# EAGLE schematic Protein (EAGLE 6.5.0)

## Sheet 1 of 2
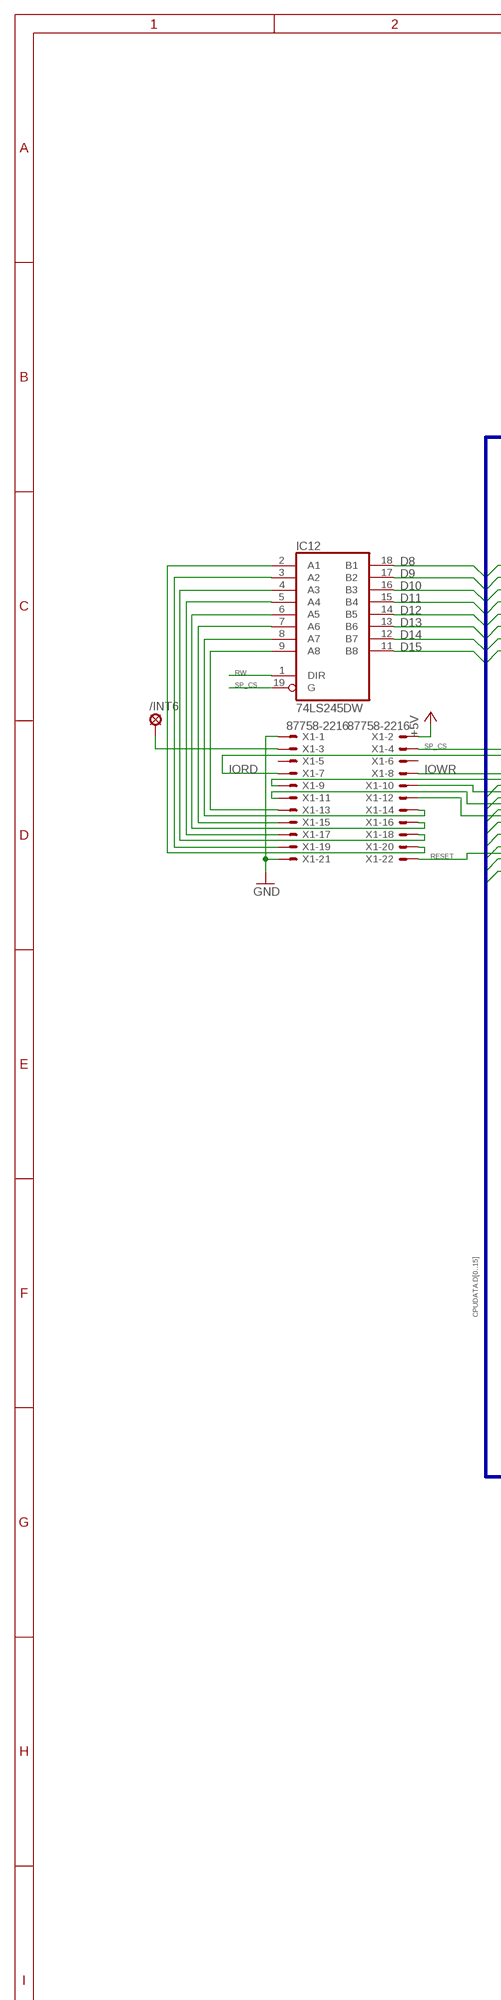
[diagram p0: schematic, sheet 1, part 1 of 2]
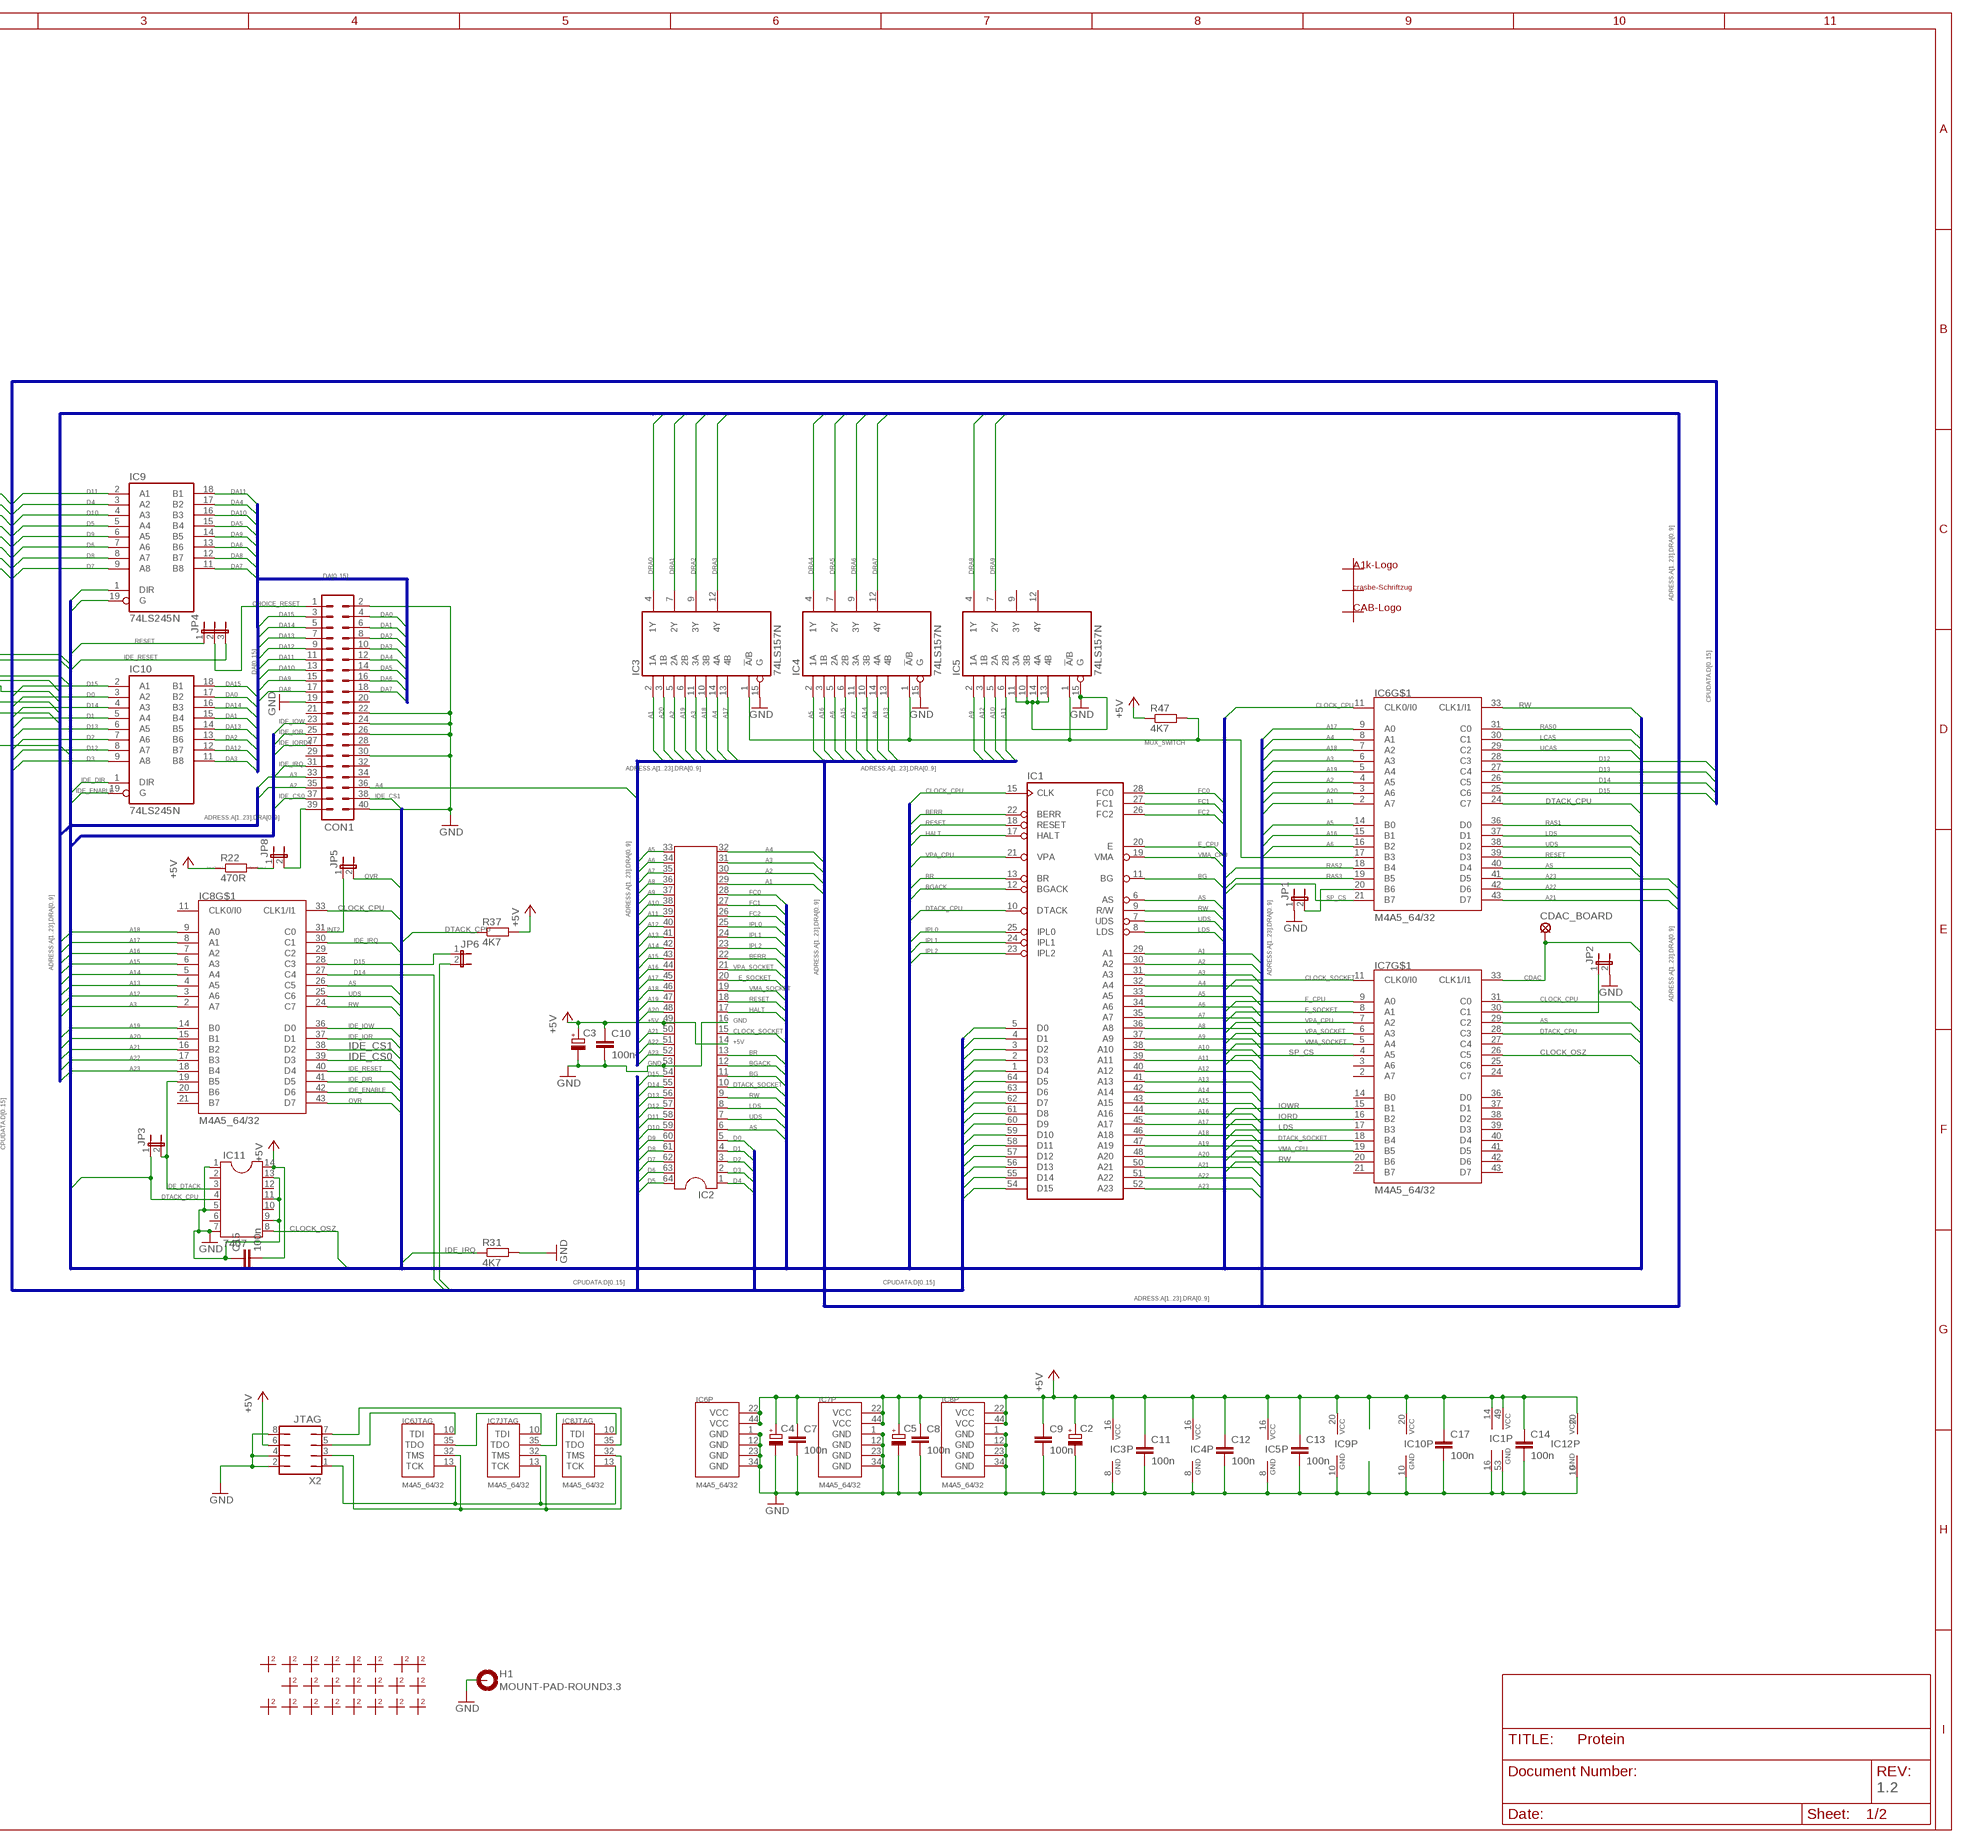
[diagram p1: schematic, sheet 1, part 2 of 2]

### Parts
/INT6  SE11  [SE11]
C2  CPOL-EUE2.5-7  [E2,5-7]
C3  CPOL-EUE2.5-7  [E2,5-7]
C4  CPOL-EUE2.5-7  [E2,5-7]
C5  CPOL-EUE2.5-7  [E2,5-7]
C7  100n  C-EU025-024X044  [C025-024X044]
C8  100n  C-EU025-024X044  [C025-024X044]
C9  100n  C-EU025-024X044  [C025-024X044]
C10  100n  C-EU025-024X044  [C025-024X044]
C11  100n  C-EU025-024X044  [C025-024X044]
C12  100n  C-EU025-024X044  [C025-024X044]
C13  100n  C-EU025-024X044  [C025-024X044]
C14  100n  C-EUC1206K  [C1206K]
C15  100n  C-EU025-024X044  [C025-024X044]
C17  100n  C-EU025-024X044  [C025-024X044]
CDAC_BOARD  SE11  [SE11]
CON1  ML40  [ML40]
H1  MOUNT-PAD-ROUND3.3  [3,3-PAD]
IC1  MC68000P  [DIL64]
IC2  DIL64  [DIL64]
IC3  74LS157N  74157N  [DIL16]
IC4  74LS157N  74157N  [DIL16]
IC5  74LS157N  74157N  [DIL16]
IC6  M4A5_64/32  [PLCC-S44]
IC7  M4A5_64/32  [PLCC-S44]
IC8  M4A5_64/32  [PLCC-S44]
IC9  74LS245N  [DIL20]
IC10  74LS245N  [DIL20]
IC11  7407  DIL14  [DIL14]
IC12  74LS245DW  [SO20W]
JP1  JP1E  [JP1]
JP2  JP1E  [JP1]
JP3  JP1E  [JP1]
JP4  JP2E  [JP2]
JP5  JP1E  [JP1]
JP6  JP1E  [JP1]
JP8  JP1E  [JP1]
R22  470R  R0207/10  [0207/10]
R31  4K7  R-EU_M0805  [M0805]
R37  4K7  R-EU_M0805  [M0805]
R47  4K7  R-EU_M0805  [M0805]
U$1  A1K  [A1K]
U$2  CRASBE  [CRASBE]
U$3  CAB  [CAB-LOGO]
U$5  BREAD_2  [BREAD]
U$8  BREAD_2  [BREAD]
U$9  BREAD_2  [BREAD]
U$10  BREAD_2  [BREAD]
U$11  BREAD_2  [BREAD]
U$13  BREAD_2  [BREAD]
U$14  BREAD_2  [BREAD]
U$15  BREAD_2  [BREAD]
U$16  BREAD_2  [BREAD]
U$17  BREAD_2  [BREAD]
U$18  BREAD_2  [BREAD]
U$19  BREAD_2  [BREAD]
U$20  BREAD_2  [BREAD]
U$21  BREAD_2  [BREAD]
U$22  BREAD_2  [BREAD]
U$23  BREAD_2  [BREAD]
U$24  BREAD_2  [BREAD]
U$25  BREAD_2  [BREAD]
U$26  BREAD_2  [BREAD]
U$27  BREAD_2  [BREAD]
U$28  BREAD_2  [BREAD]
U$29  BREAD_2  [BREAD]
U$30  BREAD_2  [BREAD]
X1  87758-2216  [87758-2216]
X2  JTAG  JP4Q  [JP4Q]

### Nets
+5V: C2.+ C3.+ C4.+ C5.+ C7.1 C8.1 C9.1 C10.1 C11.1 C12.1 C13.1 C14.1 C15.2 C17.1 IC1.14(VCC) IC1.49(VCC) IC2.14 IC2.49 IC3.16(VCC) IC4.16(VCC) IC5.16(VCC) IC6.22(P:VCC) IC6.44(P:VCC) IC7.22(P:VCC) IC7.44(P:VCC) IC8.22(P:VCC) IC8.44(P:VCC) IC9.20(VCC) IC10.20(VCC) IC11.14 IC12.20(VCC) R22.1 R37.2 R47.1 X1.2 X2.6 ; also sheet 2
A1: IC1.29(A1) IC2.29 IC3.2(1A) IC6.2(A7)
A2: CON1.35 IC1.30(A2) IC2.30 IC3.5(2A) IC6.4(A5) X1.12
A3: CON1.33 IC1.31(A3) IC2.31 IC3.11(3A) IC6.6(A3) IC8.2(A7) X1.11
A4: CON1.36 IC1.32(A4) IC2.32 IC3.14(4A) IC6.8(A1) X1.10
A5: IC1.33(A5) IC2.33 IC4.2(1A) IC6.14(B0) X1.9
A6: IC1.34(A6) IC2.34 IC4.5(2A) IC6.16(B2)
A7: IC1.35(A7) IC2.35 IC4.11(3A)
A8: IC1.36(A8) IC2.36 IC4.14(4A)
A9: IC1.37(A9) IC2.37 IC5.2(1A)
A10: IC1.38(A10) IC2.38 IC5.5(2A)
A11: IC1.39(A11) IC2.39 IC5.6(2B)
A12: IC1.40(A12) IC2.40 IC5.3(1B) IC8.3(A6)
A13: IC1.41(A13) IC2.41 IC4.13(4B) IC8.4(A5)
A14: IC1.42(A14) IC2.42 IC4.10(3B) IC8.5(A4)
A15: IC1.43(A15) IC2.43 IC4.6(2B) IC8.6(A3)
A16: IC1.44(A16) IC2.44 IC4.3(1B) IC6.15(B1) IC8.7(A2)
A17: IC1.45(A17) IC2.45 IC3.13(4B) IC6.9(A0) IC8.8(A1)
A18: IC1.46(A18) IC2.46 IC3.10(3B) IC6.7(A2) IC8.9(A0)
A19: IC1.47(A19) IC2.47 IC3.6(2B) IC6.5(A4) IC8.14(B0)
A20: IC1.48(A20) IC2.48 IC3.3(1B) IC6.3(A6) IC8.15(B1)
A21: IC1.50(A21) IC2.50 IC6.43(D7) IC8.16(B2)
A22: IC1.51(A22) IC2.51 IC6.42(D6) IC8.17(B3)
A23: IC1.52(A23) IC2.52 IC6.41(D5) IC8.18(B4)
AS: IC1.6(AS) IC2.6 IC6.40(D4) IC7.29(C2) IC8.26(C5)
BERR: IC1.22(BERR) IC2.22
BG: IC1.11(BG) IC2.11
BGACK: IC1.12(BGACK) IC2.12
BR: IC1.13(BR) IC2.13
CDAC: CDAC_BOARD.MP IC7.33(CLK1/I1)
CHOICE_RESET: CON1.1 JP4.2
CLOCK_CPU: IC1.15(CLK) IC6.11(CLK0/I0) IC7.31(C0) IC8.33(CLK1/I1)
CLOCK_OSZ: IC7.26(C5) IC11.8
CLOCK_SOCKET: IC2.15 IC7.11(CLK0/I0)
D0: IC1.5(D0) IC2.5 IC10.3(A2) ; also sheet 2
D1: IC1.4(D1) IC2.4 IC10.5(A4) ; also sheet 2
D2: IC1.3(D2) IC2.3 IC10.7(A6) ; also sheet 2
D3: IC1.2(D3) IC2.2 IC10.9(A8) ; also sheet 2
D4: IC1.1(D4) IC2.1 IC9.3(A2) ; also sheet 2
D5: IC1.64(D5) IC2.64 IC9.5(A4) ; also sheet 2
D6: IC1.63(D6) IC2.63 IC9.7(A6) ; also sheet 2
D7: IC1.62(D7) IC2.62 IC9.9(A8) ; also sheet 2
D8: IC1.61(D8) IC2.61 IC9.8(A7) IC12.18(B1) ; also sheet 2
D9: IC1.60(D9) IC2.60 IC9.6(A5) IC12.17(B2) ; also sheet 2
D10: IC1.59(D10) IC2.59 IC9.4(A3) IC12.16(B3) ; also sheet 2
D11: IC1.58(D11) IC2.58 IC9.2(A1) IC12.15(B4) ; also sheet 2
D12: IC1.57(D12) IC2.57 IC6.28(C3) IC10.8(A7) IC12.14(B5) ; also sheet 2
D13: IC1.56(D13) IC2.56 IC6.27(C4) IC10.6(A5) IC12.13(B6) ; also sheet 2
D14: IC1.55(D14) IC2.55 IC6.26(C5) IC8.27(C4) IC10.4(A3) IC12.12(B7) ; also sheet 2
D15: IC1.54(D15) IC2.54 IC6.25(C6) IC10.2(A1) IC12.11(B8) JP6.2 ; also sheet 2
DA0: CON1.4 IC10.17(B2)
DA1: CON1.6 IC10.15(B4)
DA2: CON1.8 IC10.13(B6)
DA3: CON1.10 IC10.11(B8)
DA4: CON1.12 IC9.17(B2)
DA5: CON1.14 IC9.15(B4)
DA6: CON1.16 IC9.13(B6)
DA7: CON1.18 IC9.11(B8)
DA8: CON1.17 IC9.12(B7)
DA9: CON1.15 IC9.14(B5)
DA10: CON1.13 IC9.16(B3)
DA11: CON1.11 IC9.18(B1)
DA12: CON1.9 IC10.12(B7)
DA13: CON1.7 IC10.14(B5)
DA14: CON1.5 IC10.16(B3)
DA15: CON1.3 IC10.18(B1)
DRA0: IC3.4(1Y) ; also sheet 2
DRA1: IC3.7(2Y) ; also sheet 2
DRA2: IC3.9(3Y) ; also sheet 2
DRA3: IC3.12(4Y) ; also sheet 2
DRA4: IC4.4(1Y) ; also sheet 2
DRA5: IC4.7(2Y) ; also sheet 2
DRA6: IC4.9(3Y) ; also sheet 2
DRA7: IC4.12(4Y) ; also sheet 2
DRA8: IC5.4(1Y) ; also sheet 2
DRA9: IC5.7(2Y) ; also sheet 2
DTACK_CPU: IC1.10(DTACK) IC6.24(C7) IC7.28(C3) IC11.4 JP3.1 R37.1
DTACK_SOCKET: IC2.10 IC7.18(B4)
E_CPU: IC1.20(E) IC7.9(A0)
E_SOCKET: IC2.20 IC7.8(A1)
FC0: IC1.28(FC0) IC2.28
FC1: IC1.27(FC1) IC2.27
FC2: IC1.26(FC2) IC2.26
GND: C2.- C3.- C4.- C5.- C7.2 C8.2 C9.2 C10.2 C11.2 C12.2 C13.2 C14.2 C15.1 C17.2 CON1.2 CON1.19 CON1.22 CON1.24 CON1.26 CON1.30 CON1.40 H1.B3,3(MOUNT) IC1.16(GND) IC1.53(GND) IC2.16 IC2.53 IC3.8(GND) IC3.15(G) IC4.8(GND) IC4.15(G) IC5.8(GND) IC5.10(3B) IC5.11(3A) IC5.13(4B) IC5.14(4A) IC5.15(G) IC6.1(P:GND) IC6.12(P:GND) IC6.23(P:GND) IC6.34(P:GND) IC7.1(P:GND) IC7.12(P:GND) IC7.23(P:GND) IC7.34(P:GND) IC8.1(P:GND) IC8.12(P:GND) IC8.23(P:GND) IC8.34(P:GND) IC9.10(GND) IC10.10(GND) IC11.1 IC11.5 IC11.7 IC11.9 IC11.11 IC11.13 IC12.10(GND) JP1.1 JP2.2 R31.2 X1.1 X1.21 X2.2 X2.4 X2.8 ; also sheet 2
HALT: IC1.17(HALT) IC2.17
IDE_CS0: CON1.37 IC8.39(D3)
IDE_CS1: CON1.38 IC8.38(D2)
IDE_DIR: IC8.41(D5) IC9.1(DIR) IC10.1(DIR)
IDE_DTACK: IC8.19(B5) IC11.3 JP3.2
IDE_ENABLE: IC8.42(D6) IC9.19(G) IC10.19(G)
IDE_IOR: CON1.25 IC8.37(D1)
IDE_IORDY: CON1.27
IDE_IOW: CON1.23 IC8.36(D0)
IDE_IRQ: CON1.31 IC8.30(C1) R31.1
IDE_RESET: IC8.40(D4) JP4.3
INT2: IC8.31(C0) JP5.1
IORD: IC7.16(B2) X1.7
IOWR: IC7.15(B1) X1.8
IPL0: IC1.25(IPL0) IC2.25
IPL1: IC1.24(IPL1) IC2.24
IPL2: IC1.23(IPL2) IC2.23
LCAS: IC6.30(C1) ; also sheet 2
LDS: IC1.8(LDS) IC2.8 IC6.37(D1) IC7.17(B3)
MUX_SWITCH: IC3.1(!A!/B) IC4.1(!A!/B) IC5.1(!A!/B) IC6.17(B3) R47.2
N$1: IC6.20(B6) JP1.2
N$3: IC8.28(C3) JP6.1
N$4: IC7.30(C1) JP2.1
N$5: JP8.1 R22.2
N$10: CON1.39 JP8.2
N$13: IC6.35(JTAG:TDO) IC7.10(JTAG:TDI)
N$14: IC7.35(JTAG:TDO) IC8.10(JTAG:TDI)
N$15: /INT6.MP X1.3
N$18: IC12.8(A7) X1.14
N$20: IC12.9(A8) X1.13
N$22: IC12.7(A6) X1.15
N$23: IC12.6(A5) X1.16
N$25: IC12.5(A4) X1.17
N$26: IC12.4(A3) X1.18
N$27: IC12.3(A2) X1.19
N$29: IC12.2(A1) X1.20
OVR: IC8.43(D7) JP5.2
RAS0: IC6.31(C0) ; also sheet 2
RAS1: IC6.36(D0) ; also sheet 2
RAS2: IC6.18(B4) ; also sheet 2
RAS3: IC6.19(B5) ; also sheet 2
RESET: IC1.18(RESET) IC2.18 IC6.39(D3) JP4.1 X1.22
RW: IC1.9(R/W) IC2.9 IC6.33(CLK1/I1) IC7.20(B6) IC8.24(C7) IC12.1(DIR) ; also sheet 2
SP_CS: IC6.21(B7) IC7.4(A5) IC12.19(G) X1.4
TCK: IC6.13(JTAG:TCK) IC7.13(JTAG:TCK) IC8.13(JTAG:TCK) X2.1
TDI: IC8.35(JTAG:TDO) X2.7
TDO: IC6.10(JTAG:TDI) X2.5
TMS: IC6.32(JTAG:TMS) IC7.32(JTAG:TMS) IC8.32(JTAG:TMS) X2.3
UCAS: IC6.29(C2) ; also sheet 2
UDS: IC1.7(UDS) IC2.7 IC6.38(D2) IC8.25(C6)
VMA_CPU: IC1.19(VMA) IC7.19(B5)
VMA_SOCKET: IC2.19 IC7.5(A4)
VPA_CPU: IC1.21(VPA) IC7.7(A2)
VPA_SOCKET: IC2.21 IC7.6(A3)
Unconnected: CON1.20 CON1.21 CON1.28 CON1.29 CON1.32 CON1.34 IC5.9(3Y) IC5.12(4Y) IC7.2(A7) IC7.3(A6) IC7.14(B0) IC7.21(B7) IC7.24(C7) IC7.25(C6) IC7.27(C4) IC7.36(D0) IC7.37(D1) IC7.38(D2) IC7.39(D3) IC7.40(D4) IC7.41(D5) IC7.42(D6) IC7.43(D7) IC8.11(CLK0/I0) IC8.20(B6) IC8.21(B7) IC8.29(C2) IC11.2 IC11.6 IC11.10 IC11.12 X1.5 X1.6

### Buses
ADRESS:A[1..23],DRA[0..9]
CPUDATA:D[0..15]
UDS,LDS,AS,RESET,RW,RAS1,RAS0,UCAS,LCAS,RAS2,RAS3,BG,VMA_CPU,VMA_SOCKET,E_CPU,E_SOCKET,FC[0..2],CLOCK_CPU,CLOCK_SOCKET,BERR,HALT,VPA_CPU,VPA_SOCKET,BR,BGACK,DTACK_CPU,DTACK_SOCKET,IPL[0..2],IDE_DIR,IDE_ENABLE,IDE_CS0,IDE_CS1,IDE_RESET,OVR,IDE_IOR,IDE_IOW,IDE_IRQ,CDAC,IDE_IORDY,SP_CS,IORD,CLOCK_OSZ,CLOCK_SOCKET,IOWR
DA[0..15]

### Notes on the sheet
- 1.2

## Sheet 2 of 2
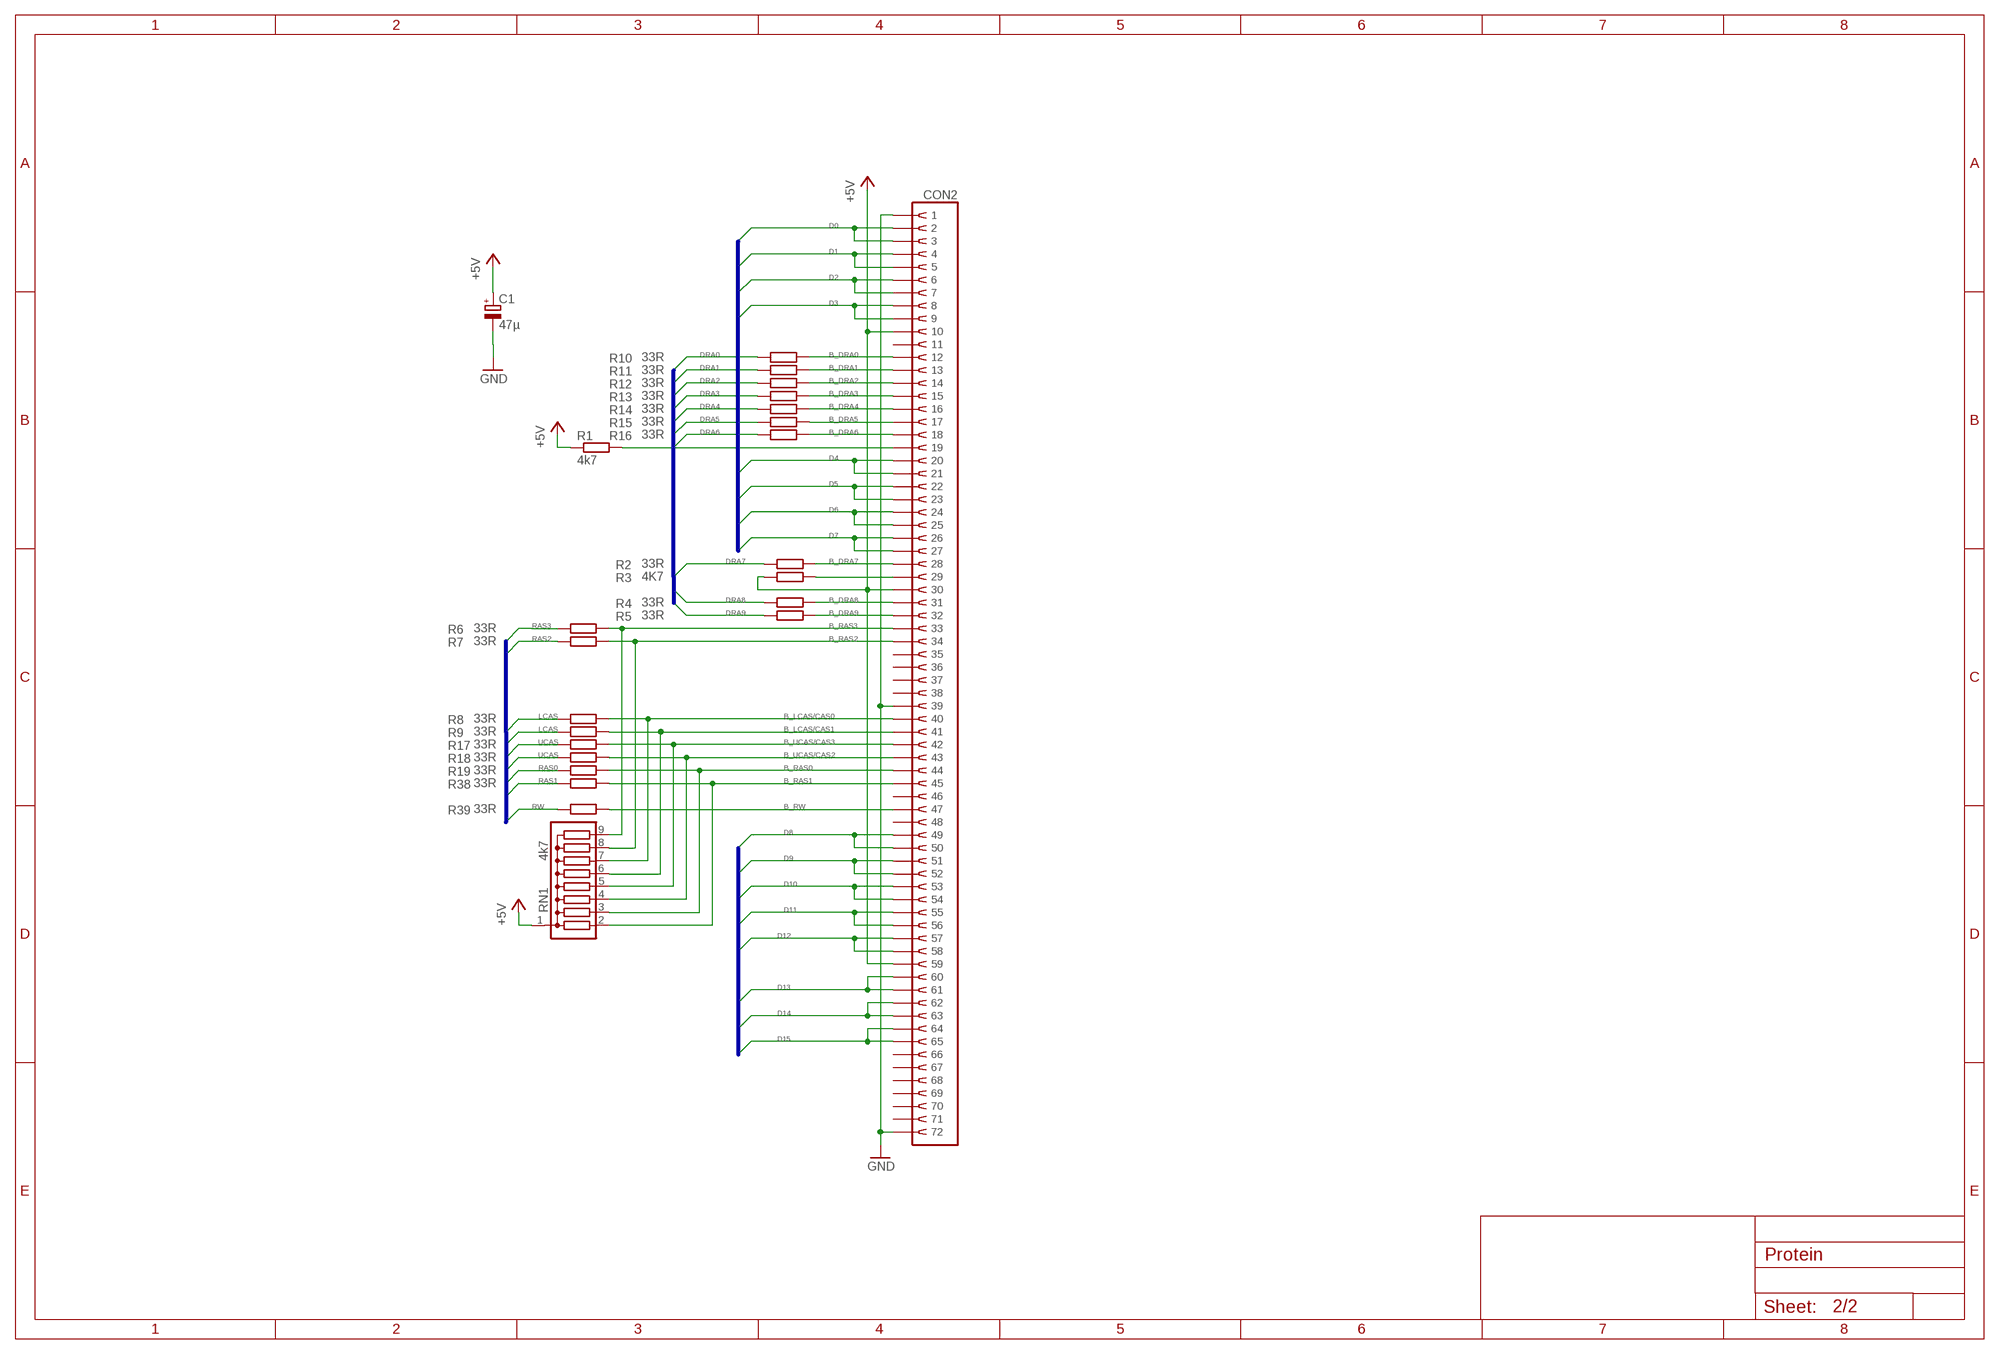
[diagram p2: schematic, sheet 2]

### Parts
C1  47µ  CPOL-EUE1.8-4  [E1,8-4]
CON2  SIMM72  [73826962]
R1  4k7  R-EU_M0805  [M0805]
R2  33R  R-EU_0207/10  [0207/10]
R3  4K7  R-EU_0207/10  [0207/10]
R4  33R  R-EU_0207/10  [0207/10]
R5  33R  R-EU_0207/10  [0207/10]
R6  33R  R-EU_0207/10  [0207/10]
R7  33R  R-EU_0207/10  [0207/10]
R8  33R  R-EU_0207/10  [0207/10]
R9  33R  R-EU_0207/10  [0207/10]
R10  33R  R-EU_0207/10  [0207/10]
R11  33R  R-EU_0207/10  [0207/10]
R12  33R  R-EU_0207/10  [0207/10]
R13  33R  R-EU_0207/10  [0207/10]
R14  33R  R-EU_0207/10  [0207/10]
R15  33R  R-EU_0207/10  [0207/10]
R16  33R  R-EU_0207/10  [0207/10]
R17  33R  R-EU_0207/10  [0207/10]
R18  33R  R-EU_0207/10  [0207/10]
R19  33R  R-EU_0207/10  [0207/10]
R38  33R  R-EU_0207/10  [0207/10]
R39  33R  R-EU_0207/10  [0207/10]
RN1  4k7  G08R  [SIL9]

### Nets
+5V: C1.+ CON2.10 CON2.30 CON2.59 R1.1 R3.1 RN1.1 ; also sheet 1
B_DRA0: CON2.12 R10.2
B_DRA1: CON2.13 R11.2
B_DRA2: CON2.14 R12.2
B_DRA3: CON2.15 R13.2
B_DRA4: CON2.16 R14.2
B_DRA5: CON2.17 R15.2
B_DRA6: CON2.18 R16.2
B_DRA7: CON2.28 R2.2
B_DRA8: CON2.31 R4.2
B_DRA9: CON2.32 R5.2
B_LCAS/CAS0: CON2.40 R8.2 RN1.7
B_LCAS/CAS1: CON2.41 R9.2 RN1.6
B_RAS0: CON2.44 R19.2 RN1.3
B_RAS1: CON2.45 R38.2 RN1.2
B_RAS2: CON2.34 R7.2 RN1.8
B_RAS3: CON2.33 R6.2 RN1.9
B_RW: CON2.47 R39.2
B_UCAS/CAS2: CON2.43 R18.2 RN1.4
B_UCAS/CAS3: CON2.42 R17.2 RN1.5
D0: CON2.2 CON2.3 ; also sheet 1
D1: CON2.4 CON2.5 ; also sheet 1
D2: CON2.6 CON2.7 ; also sheet 1
D3: CON2.8 CON2.9 ; also sheet 1
D4: CON2.20 CON2.21 ; also sheet 1
D5: CON2.22 CON2.23 ; also sheet 1
D6: CON2.24 CON2.25 ; also sheet 1
D7: CON2.26 CON2.27 ; also sheet 1
D8: CON2.49 CON2.50 ; also sheet 1
D9: CON2.51 CON2.52 ; also sheet 1
D10: CON2.53 CON2.54 ; also sheet 1
D11: CON2.55 CON2.56 ; also sheet 1
D12: CON2.57 CON2.58 ; also sheet 1
D13: CON2.60 CON2.61 ; also sheet 1
D14: CON2.62 CON2.63 ; also sheet 1
D15: CON2.64 CON2.65 ; also sheet 1
DRA0: R10.1 ; also sheet 1
DRA1: R11.1 ; also sheet 1
DRA2: R12.1 ; also sheet 1
DRA3: R13.1 ; also sheet 1
DRA4: R14.1 ; also sheet 1
DRA5: R15.1 ; also sheet 1
DRA6: R16.1 ; also sheet 1
DRA7: R2.1 ; also sheet 1
DRA8: R4.1 ; also sheet 1
DRA9: R5.1 ; also sheet 1
GND: C1.- CON2.1 CON2.39 CON2.72 ; also sheet 1
LCAS: R8.1 R9.1 ; also sheet 1
N$33: CON2.19 R1.2
N$34: CON2.29 R3.2
RAS0: R19.1 ; also sheet 1
RAS1: R38.1 ; also sheet 1
RAS2: R7.1 ; also sheet 1
RAS3: R6.1 ; also sheet 1
RW: R39.1 ; also sheet 1
UCAS: R17.1 R18.1 ; also sheet 1
Unconnected: CON2.11 CON2.35 CON2.36 CON2.37 CON2.38 CON2.46 CON2.48 CON2.66 CON2.67 CON2.68 CON2.69 CON2.70 CON2.71

### Buses
CPUDATA:D[0..15]
CLOCK_AND_CONTROLS:UDS,LDS,AS,RESET,RW,RAS1,RAS0,UCAS,LCAS,RAS2,RAS3,BG,VMA,E_CPU,E_SOCKET,FC[0..2],CLOCK_CPU,CLOCK_SOCKET,BERR,HALT,VPA_CPU,VPA_SOCKET,BR,BGACK,DTACK_CPU,DTACK_SOCKET,IPL[0..2],IDE_DIR,IDE_ENABLE,IDE_CS0,IDE_CS1,IDE_RESET,OVR,IDE_IOR,IDE_IOW,IDE_IRQ,CDAC,IDE_IORDY,SP_CS,IORD,CLOCK_OSZ,CLOCK_SOCKET
ADRESS:A[1..23],DRA[0..9]

## Library data of the parts
/INT6 CDAC_BOARD = solpad:SE11: SOLDER PAD RTM, drill 1,1mm, distributor Buerklin, 07F810
C1-C5 = rcl:CPOL-EU: POLARIZED CAPACITOR, European symbol
C7-C15 C17 = rcl:C-EU: CAPACITOR, European symbol
CON1 = con-harting-ml:ML40: HARTING; OC_FARNELL: unknown; OC_NEWARK: unknown
CON2 = con-amp:SIMM72: AMP connector
H1 = holes:MOUNT-PAD-ROUND: MOUNTING PAD, round
IC1 = micro-mc68000:MC68000P: 68xxx PROCESSOR; OC_FARNELL: unknown; OC_NEWARK: unknown
IC2 = ic-package:DIL64: Dual In Line
IC3-IC5 = 74xx-eu:74*157: Quadruple 2-line to 1-line data SELECTOR/MULTIPLEXER
IC6-IC8 = protein:M4A5_64/32
IC9 IC10 IC12 = 74xx-eu:74*245: Octal BUS TRANSCEIVER, 3-state
IC11 = ic-package:DIL14: Dual In Line / Socket
JP1-JP3 JP5 JP6 JP8 = jumper:JP1E: JUMPER
JP4 = jumper:JP2E: JUMPER
R1-R19 R31 R37-R39 R47 = rcl:R-EU_: RESISTOR, European symbol
R22 = eagle-ltspice:R: RESISTOR, European symbol; SPICEMODEL: NONE; SPICEPREFIX: R
RN1 = resistor-sil:G08R: SIL RESISTOR; OC_FARNELL: unknown; OC_NEWARK: unknown
U$1 = logos:A1K
U$2 = logos:CRASBE
U$3 = logos:CAB
U$5 U$8-U$11 U$13-U$30 = protein:BREAD_2
X1 = con-molex:87758-2216: 22 Pin - 2mm Dual Row Single Wafer, Vertical T/H HDR Source: http://www.molex.com/pdm_docs/sd/877580616_sd.pdf; MPN: 87758-2216; OC_FARNELL: unknown; OC_NEWARK: 94M1536
X2 = jumper:JP4Q: JUMPER